# EAGLE schematic Eurorack_CV_Input (EAGLE 9.6.2)
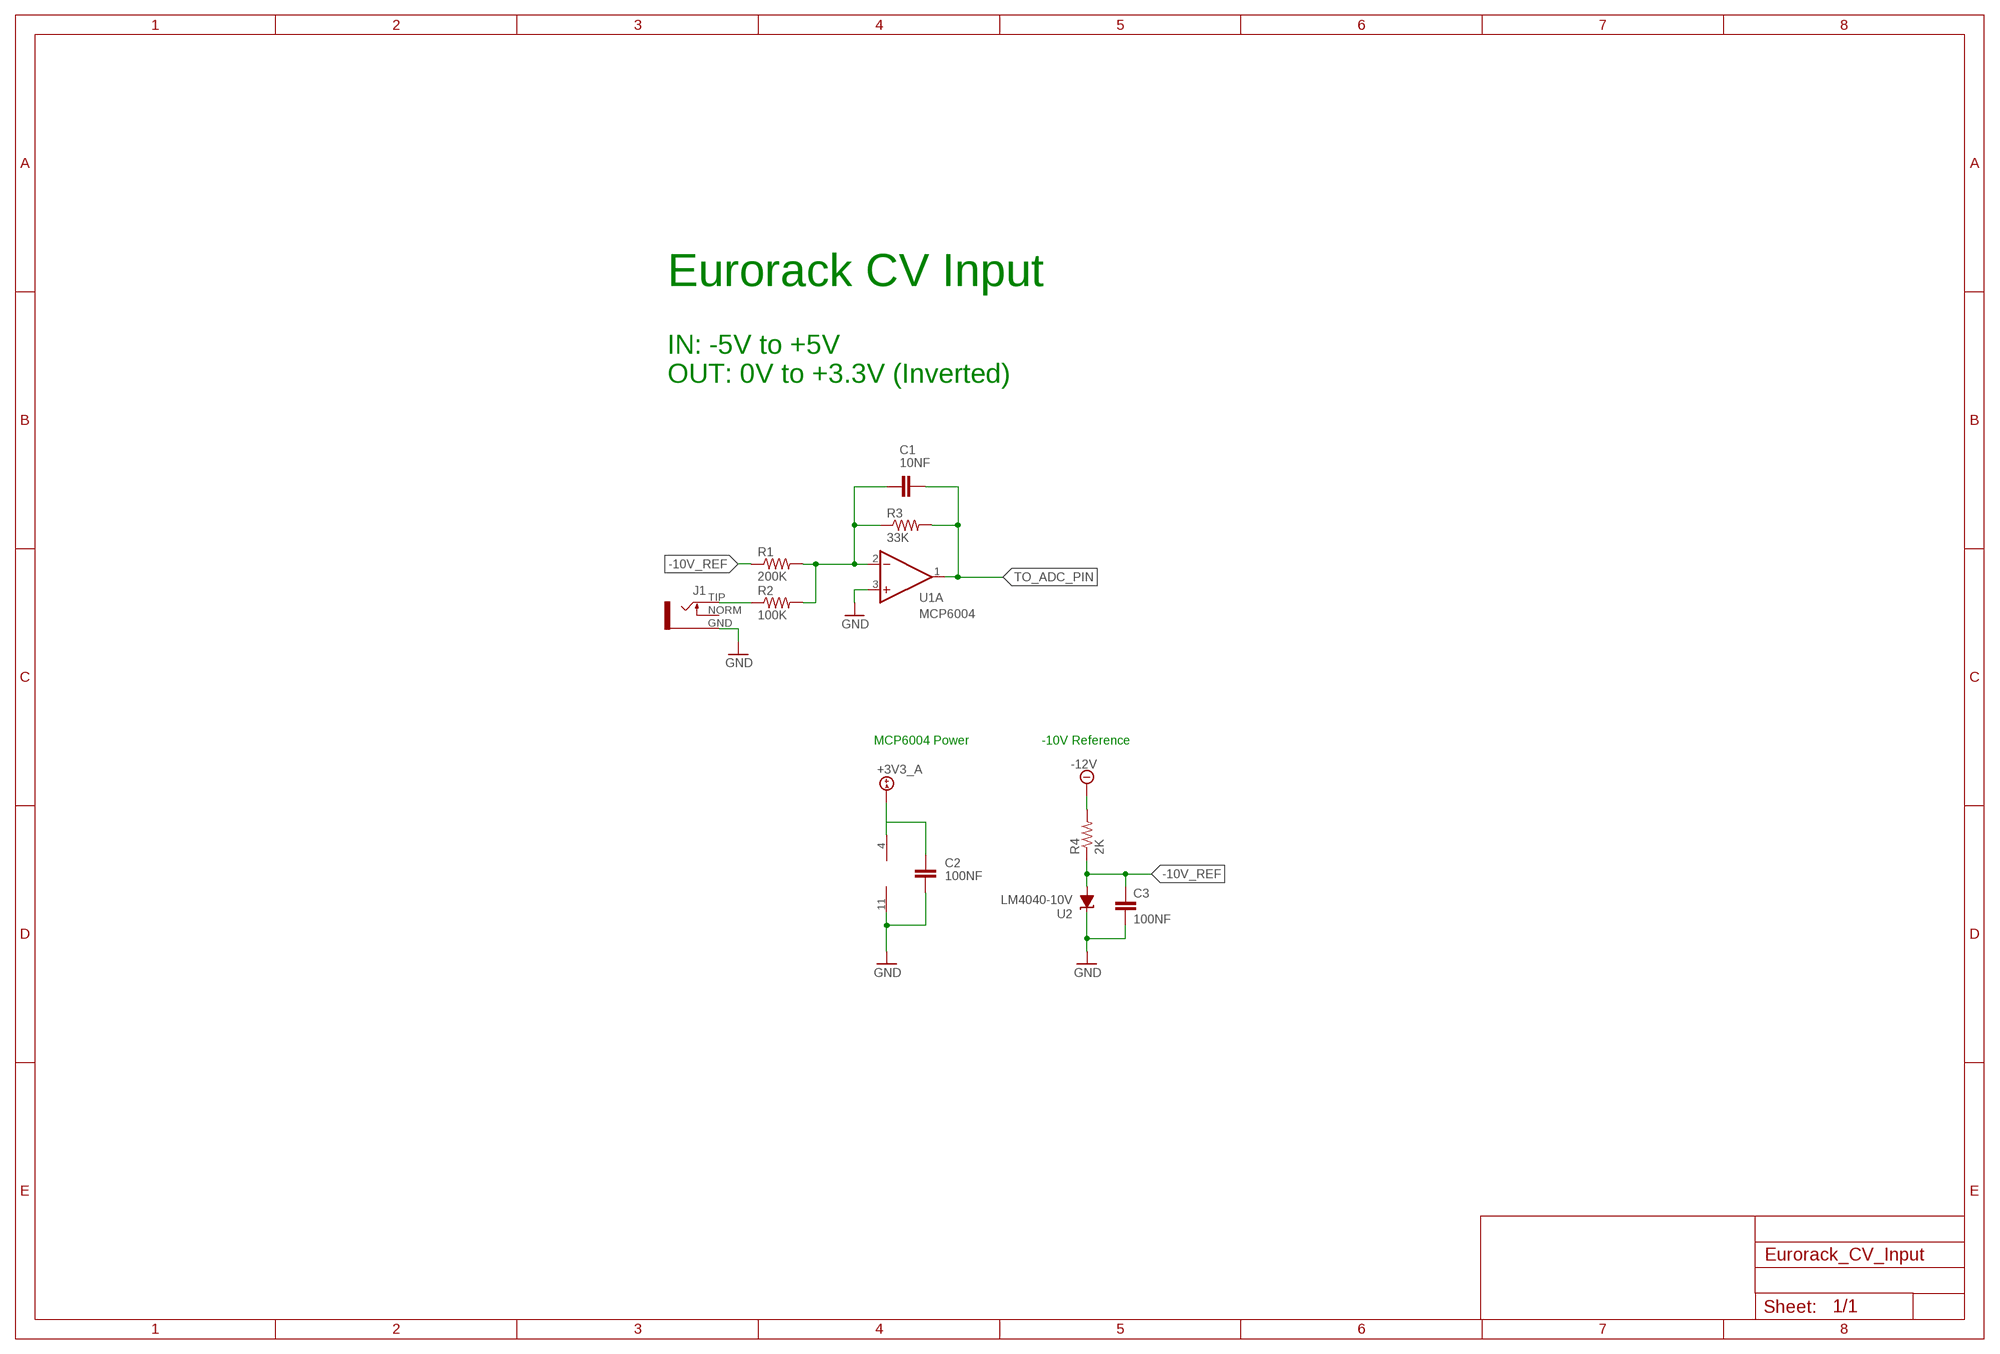
[diagram p0: schematic, sheet 1]

## Parts
C1  10NF  C-EUC0603  [C0603]
C2  100NF  C-EUC0603  [C0603]
C3  100NF  C-EUC0603  [C0603]
J1  Eurorack Jack  EURO_JACK  [S_JACK]
R1  200K  R-US_R0603  [R0603]
R2  100K  R-US_R0603  [R0603]
R3  33K  R-US_R0603  [R0603]
R4  2K  R-US_R0603  [R0603]
U1  MCP6004  MCP6004_TSSOP-14  [TSSOP-14]
U2  LM4040-10V  LM4040-10VA12DBZ  [DBZ_R-PDSO-G3]

## Nets
+3V3_A: C2.2 U1.4(P:V+)
-10V_REF: C3.1 R1.1 R4.1 U2.2(A)
-12V: R4.2
GND: C2.1 C3.2 J1.GND U1.3(A:+IN) U1.11(P:V-) U2.1(C)
N$1: J1.TIP R2.1
N$3: C1.1 R1.2 R2.2 R3.1 U1.2(A:-IN)
TO_ADC_PIN: C1.2 R3.2 U1.1(A:OUT)
Unconnected: J1.NORM U1.5(B:+IN) U1.6(B:-IN) U1.7(B:OUT) U1.8(C:OUT) U1.9(C:-IN) U1.10(C:+IN) U1.12(D:+IN) U1.13(D:-IN) U1.14(D:OUT)

## Notes on the sheet
- Eurorack CV Input
- IN: -5V to +5V
  OUT: 0V to +3.3V (Inverted)
- MCP6004 Power | -10V Reference

## Library data of the parts
C1-C3 = Electrosmith-Passives:C-EU: CAPACITOR, European symbol; PACKAGE: C0603
J1 = Electrosmith-Interface:EURO_JACK
R1-R4 = Electrosmith-Passives:R-US_: RESISTOR, American symbol; PACKAGE: R0603
U1 = Electrosmith-IC:MCP6004; BIN#: N/A; IPN: MCP6004 TSSOP-14; MPN: MCP6004T-E/ST; PACKAGE: TSSOP-14
U2 = Electrosmith-Power:LM4040-10V: PRECISION MICROPOWER SHUNT VOLTAGE REFERENCE Source: http://focus.ti.com/lit/ds/slcs146e/slcs146e.pdf; IPN: LM4040-10V; MPN: LM4041A12IDBZR; OC_FARNELL: 1407949; OC_NEWARK: 58K5875; PACKAGE: SOT-23

## Net classes
0 default: width 0.203 mm